# Altium project AQFlow_PCB.PrjPcb
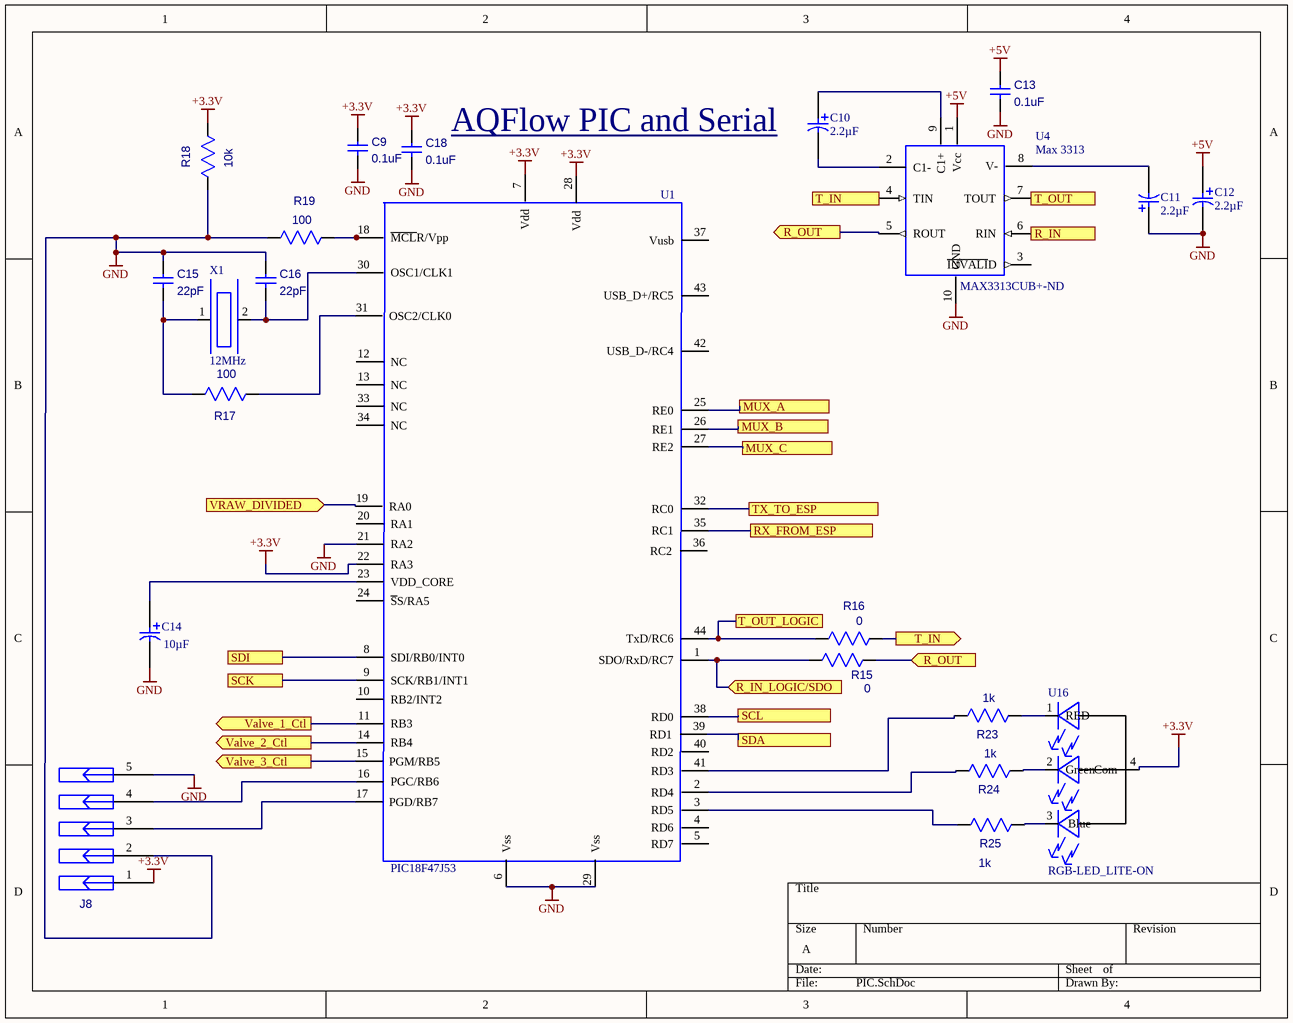
[diagram p0: PIC.SchDoc]
2 sheets, 58 parts. Net scope: flat (ports and power ports of the same name join across sheets).
Board file: AQFlow_PCB.PcbDoc
Sheets:
  PIC.SchDoc
  Power.SchDoc

## Sheet PIC.SchDoc
size A

### Parts
C9  value 0.1uF  [CC1206]  (hidden comment: CC1206)
C10  Capacitance: 2.2µF  [Cap_Pol_0805]  (hidden comment: Cap_Pol_0805)
C11  Capacitance: 2.2µF  [Cap_Pol_0805]  (hidden comment: Cap_Pol_0805)
C12  Capacitance: 2.2µF  [Cap_Pol_0805]  (hidden comment: Cap_Pol_0805)
C13  value 0.1uF  [CC1206]  (hidden comment: CC1206)
C14  Capacitance: 10µF  [Cap_Pol_0805]  (hidden comment: CAP_POL_0805 Generic)
C15  value 22pF  [CC1206]  (hidden comment: CC1206)
C16  value 22pF  [CC1206]  (hidden comment: CC1206)
C18  value 0.1uF  [CC1206]  (hidden comment: CC1206)
J8  HDR_MTA_5X100  [HDR_MTA_5X100]  (value not drawn)
R15  value 0  [RC1206]  (hidden comment: RC1206)
R16  value 0  [RC1206]  (hidden comment: RC1206)
R17  value 100  [RC1206]  (hidden comment: RC1206)
R18  value 10k  [RC1206]  (hidden comment: RC1206)
R19  value 100  [RC1206]  (hidden comment: RC1206)
R23  value 1k  [RC1206]  (hidden comment: RC1206)
R24  value 1k  [RC1206]  (hidden comment: RC1206)
R25  value 1k  [RC1206]  (hidden comment: RC1206)
U1  PIC18F47J53  [44-TQFP]
U4  Max 3313  Supplier Part Number 1: MAX3313CUB+-ND  [uSOP]
U16  RGB-LED_LITE-ON  [LTST-C19HE1WT]
X1  12MHz  [XTAL_MINI_ABM3]

### Ports
MUX_A, MUX_B, MUX_C, R_IN (in), R_IN_LOGIC/SDO (in), R_OUT (in), R_OUT (out), RX_FROM_ESP, SCK, SCL, SDA, SDI, T_IN (in), T_IN (out), T_OUT (out), T_OUT_LOGIC, TX_TO_ESP, Valve_1_Ctl (out), Valve_2_Ctl (out), Valve_3_Ctl (out), VRAW_DIVIDED (in)

### Nets
+3.3V: C9.1 C18.1 J8.1 R18.1 U1.7(Vdd) U1.22(RA3) U1.28(Vdd) U16.4(Com)
+5V: C12.plus C13.1 U4.1(Vcc)
GND: C9.2 C11.plus C12.minus C13.2 C14.minus C15.1 C16.1 C18.2 J8.2 J8.5 R18.2 R19.1 U1.6(Vss) U1.21(RA2) U1.29(Vss) U4.10(GND)
NetC10_minus: C10.minus U4.2(C1-)
NetC10_plus: C10.plus U4.9(C1+)
NetC11_minus: C11.minus U4.8(V-)
NetC14_plus: C14.plus U1.23(VDD_CORE)
NetC15_2: C15.2 R17.1 X1.1
NetC16_2: C16.2 U1.30(OSC1/CLK1) X1.2
NetJ1_3: U4.7(TOUT) ; port T_OUT
NetJ1_4: U4.6(RIN) ; port R_IN
NetJ1_5: U1.9(SCK/RB1/INT1) ; port SCK
NetJ1_6: U1.8(SDI/RB0/INT0) ; port SDI
NetJ1_7: R15.1 U1.1(SDO/RxD/RC7) ; port R_IN_LOGIC/SDO
NetJ1_8: R16.1 U1.44(TxD/RC6) ; port T_OUT_LOGIC
NetJ8_3: J8.3 U1.17(PGD/RB7)
NetJ8_4: J8.4 U1.16(PGC/RB6)
NetR8_1: U1.19(RA0) ; port VRAW_DIVIDED
NetR15_2: R15.2 U4.5(ROUT) ; port R_OUT
NetR16_2: R16.2 U4.4(TIN) ; port T_IN
NetR17_2: R17.2 U1.31(OSC2/CLK0)
NetR19_2: R19.2 U1.18(~{MCL}R/Vpp)
NetR23_1: R23.1 U1.41(RD3)
NetR23_2: R23.2 U16.1(RED)
NetR24_1: R24.1 U1.2(RD4)
NetR24_2: R24.2 U16.2(Green)
NetR25_1: R25.1 U1.3(RD5)
NetR25_2: R25.2 U16.3(Blue)
NetU1_11: U1.11(RB3) ; port Valve_1_Ctl
NetU1_14: U1.14(RB4) ; port Valve_2_Ctl
NetU1_15: U1.15(PGM/RB5) ; port Valve_3_Ctl
NetU1_25: U1.25(RE0) ; port MUX_A
NetU1_26: U1.26(RE1) ; port MUX_B
NetU1_27: U1.27(RE2) ; port MUX_C
NetU1_32: U1.32(RC0) ; port TX_TO_ESP
NetU1_35: U1.35(RC1) ; port RX_FROM_ESP
NetU1_38: U1.38(RD0) ; port SCL
NetU1_39: U1.39(RD1) ; port SDA

Not connected (* = marked no-connect by the designer): U1 4(RD6) 5(RD7) 10(RB2/INT2) 12(NC) 13(NC) 20(RA1) 24(~{S}S/RA5) 33(NC) 34(NC) 36(RC2) 37(Vusb) 40(RD2) 42(USB_D-/RC4) 43(USB_D+/RC5); U4 3(~{INVALI}D)

### Notes on the sheet
- (near C10) AQFlow PIC and Serial

### Library data of the parts
C10-C12 = Cap_Pol_0805: Manufacturer: AVX Corporation; Manufacturer Part Number: TAJR225K020RNJ; Manufacturer Size Code: R; Tolerance: ±10%; Voltage - Rated: 20V; ESR (Equivalent Series Resistance): 6 Ohm; Type: Molded; Supplier 1: Digi-Key; RoHS: RoHS Compliant; Category: Capacitors; Stock 1: 9954; Pricing 1: 1=1.24, 10=1.034, 100=0.66, 250=0.55, 500=0.495, 1000=0.451 (USD); Packaging: Cut Tape (CT); Operating Temperature: -55°C ~ 125°C; Mounting Type: Surface Mount; Package / Case: 0805 (2012 Metric); Size / Dimension: 0.081" L x 0.051" W (2.05mm x 1.30mm); Height - Seated (Max): 0.047" (1.20mm); Lead Spacing: -; Features: General Purpose; Lifetime @ Temp.: -; ComponentLink1URL: http://www.avx.com/docs/Catalogs/tajlp.pdf; ComponentLink1Description: http://www.avx.com/docs/Catalogs/tajlp.pdf; Supplier Part Number 1: 478-4693-1-ND
C14 = CAP_POL_0805 Generic: Manufacturer: Rohm Semiconductor; Manufacturer Part Number: TCTP1C106M8R; Manufacturer Size Code: P; Tolerance: ±20%; Voltage - Rated: 16V; ESR (Equivalent Series Resistance): 6 Ohm; Type: Molded; Supplier 1: Digi-Key; Supplier Part Number 1: 511-1683-2-ND; RoHS: RoHS Compliant; Category: Capacitors; Stock 1: 99000; Pricing 1: 3000=0.2055, 6000=0.1918, 9000=0.18495, 15000=0.18221, 30000=0.1781, 75000=0.17468, 150000=0.16783 (USD); Packaging: Tape & Reel (TR); Operating Temperature: -55°C ~ 125°C; Mounting Type: Surface Mount; Package / Case: 0805 (2012 Metric); Size / Dimension: 0.079" L x 0.049" W (2.00mm x 1.25mm); Height - Seated (Max): 0.047" (1.20mm); Lead Spacing: -; Features: General Purpose; Lifetime @ Temp.: -; ComponentLink1URL: http://rohmfs.rohm.com/en/products/databook/datasheet/passive/tantalum_capacitor/tantalum_chip_capacitor/tct_p.pdf; ComponentLink1Description: http://rohmfs.rohm.com/en/products/databook/datasheet/passive/tantalum_capacitor/tantalum_chip_capacitor/tct_p.pdf
U1 = PIC18F47J53: PIC uController; Manufacturer: Microchip Technology; Manufacturer Part Number: PIC18F47J53T-I/PT; Core Size: 8-Bit; Speed: 48MHz; Connectivity: I²C, LIN, SPI, UART/USART, USB; Peripherals: Brown-out Detect/Reset, POR, PWM, WDT; Number of I/O: 34; Program Memory Size: 128KB (64K x 16); Program Memory Type: FLASH; RAM Size: 3.8K x 8; Voltage - Supply (Vcc/Vdd): 2.15 V ~ 3.6 V; Data Converters: A/D 13x10b/12b; Oscillator Type: Internal; Supplier 1: Digi-Key; Supplier Part Number 1: PIC18F47J53T-I/PT-ND; RoHS: RoHS Compliant; Category: Integrated Circuits (ICs); Stock 1: 0; Pricing 1: 1200=3.42999 (USD); Packaging: Tape & Reel (TR); Core Processor: PIC; EEPROM Size: -; Operating Temperature: -40°C ~ 85°C; Package / Case: 44-TQFP; Supplier Device Package: 44-TQFP (10x10); ComponentLink1URL: http://www.microchip.com/mymicrochip/filehandler.aspx?ddocname=en548986; ComponentLink1Description: http://www.microchip.com/mymicrochip/filehandler.aspx?ddocname=en548986
X1 = XTAL_MINI_ABM3
J8 = HDR_MTA_5X100: Value: *
U4 = Max 3313: Supplier 1: Digi-Key

## Sheet Power.SchDoc
size A
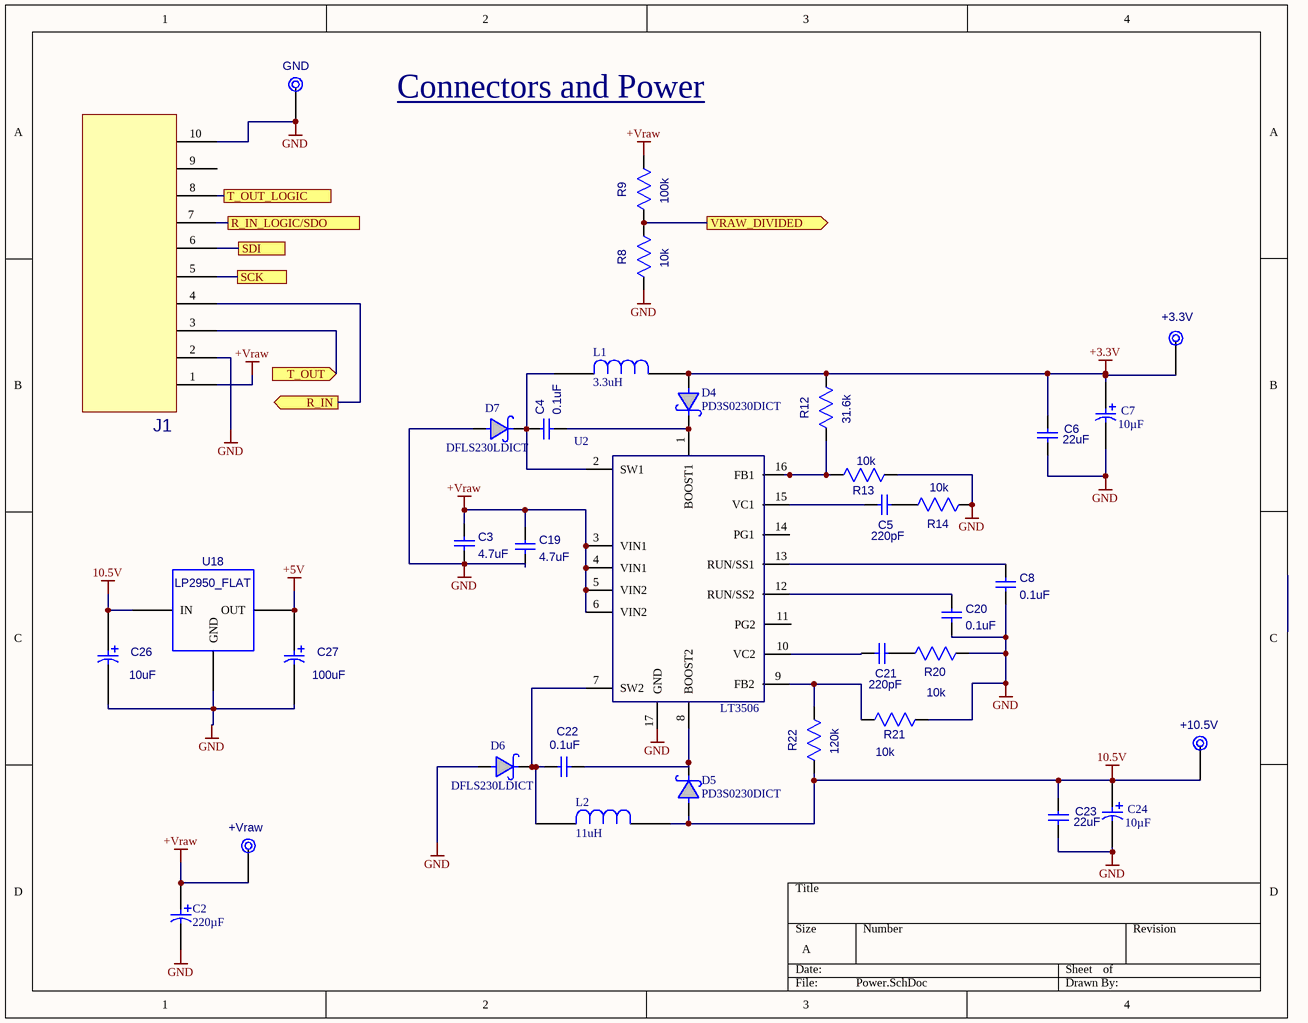
[diagram p1: Power.SchDoc]

### Parts
+5V  +3.3V  [PAD_TESTPOINT]
+10.5V  +10.5V  [PAD_TESTPOINT]
+Vraw  +Vraw  [PAD_TESTPOINT]
C2  Capacitance: 220µF  [Cap_Alu_UCL1V221MCL6GS]  (hidden comment: CAP_POL_Alu)
C3  value 4.7uF  [CC1206]  (hidden comment: CC1206)
C4  value 0.1uF  [CC1206]  (hidden comment: CC1206)
C5  value 220pF  [CC1206]  (hidden comment: CC1206)
C6  value 22uF  [CC1206]  (hidden comment: CC1206)
C7  Capacitance: 10µF  [Cap_Pol_0805]  (hidden comment: CAP_POL_0805 Generic)
C8  value 0.1uF  [CC1206]
C19  value 4.7uF  [CC1206]  (hidden comment: CC1206)
C20  value 0.1uF  [CC1206]
C21  value 220pF  [CC1206]  (hidden comment: CC1206)
C22  value 0.1uF  [CC1206]  (hidden comment: CC1206)
C23  value 22uF  [CC1206]  (hidden comment: CC1206)
C24  Capacitance: 10µF  [Cap_Pol_0805]  (hidden comment: CAP_POL_0805 Generic)
C26  value 10uF  [CAP_D_SMT_CAP_POL_D_PKG(Primary)]  (hidden comment: CAP_POL_D_PKG)
C27  value 100uF  [CAP_D_SMT_CAP_POL_D_PKG(Primary)]  (hidden comment: CAP_POL_D_PKG)
D4  PD3S0230DICT  [POWERDI123]
D5  PD3S0230DICT  [POWERDI123]
D6  DFLS230LDICT  [POWERDI123]
D7  DFLS230LDICT  [POWERDI123]
GND  GND  [PAD_TESTPOINT]
J1  TERM_BLOCK_10  [Terminal Block 10 Pos]  (value not drawn)
L1  value 3.3uH  [Inductor_Small]  (hidden comment: Inductor)
L2  value 11uH  [7447798111]  (hidden comment: Inductor)
R8  value 10k  [RC1206]  (hidden comment: RC1206)
R9  value 100k  [RC1206]  (hidden comment: RC1206)
R12  value 31.6k  [RC1206]  (hidden comment: RC1206)
R13  value 10k  [RC1206]  (hidden comment: RC1206)
R14  value 10k  [RC1206]  (hidden comment: RC1206)
R20  value 10k  [RC1206]  (hidden comment: RC1206)
R21  value 10k  [RC1206]  (hidden comment: RC1206)
R22  value 120k  [RC1206]  (hidden comment: RC1206)
U2  LT3506  [TSSOP16 Bottom Pad]
U18  LP2950_FLAT  [TO-252]

### Ports
R_IN (out), R_IN_LOGIC/SDO, SCK, SDI, T_OUT (in), T_OUT_LOGIC, VRAW_DIVIDED (out)

### Nets
10.5V: C26.plus U18.1(IN)
+3.3V: +5V.TP C6.1 C7.plus D4.A L1.1 R12.1
+5V: C27.plus U18.3(OUT)
+Vraw: +Vraw.TP C2.plus C3.1 C19.1 J1.1(P1) R9.1 U2.3(VIN1) U2.4(VIN1) U2.5(VIN2) U2.6(VIN2)
GND: C2.minus C3.2 C6.2 C7.minus C8.2 C19.2 C20.2 C23.2 C24.minus C26.minus C27.minus D6.A D7.A GND.TP J1.2(P2) J1.10(P10) R8.2 R13.2 R14.2 R20.2 R21.2 U2.17(GND) U18.2(GND)
Net+10.5V_TP: +10.5V.TP C23.1 C24.plus D5.A L2.1 R22.2
NetC4_1: C4.1 D7.K L1.2 U2.2(SW1)
NetC4_2: C4.2 D4.K U2.1(BOOST1)
NetC5_1: C5.1 R14.1
NetC5_2: C5.2 U2.15(VC1)
NetC8_1: C8.1 U2.13(RUN/SS1)
NetC20_1: C20.1 U2.12(RUN/SS2)
NetC21_1: C21.1 R20.1
NetC21_2: C21.2 U2.10(VC2)
NetC22_1: C22.1 D6.K L2.2 U2.7(SW2)
NetC22_2: C22.2 D5.K U2.8(BOOST2)
NetJ1_3: J1.3(P3) ; port T_OUT
NetJ1_4: J1.4(P4) ; port R_IN
NetJ1_5: J1.5(P5) ; port SCK
NetJ1_6: J1.6(P6) ; port SDI
NetJ1_7: J1.7(P7) ; port R_IN_LOGIC/SDO
NetJ1_8: J1.8(P8) ; port T_OUT_LOGIC
NetR8_1: R8.1 R9.2 ; port VRAW_DIVIDED
NetR12_2: R12.2 R13.1 U2.16(FB1)
NetR21_1: R21.1 R22.1 U2.9(FB2)

Not connected (* = marked no-connect by the designer): J1 9(P9); U2 11(PG2) 14(PG1)

### Notes on the sheet
- Connectors and Power
- Labels drawn without touching a wire or pin: 10.5V

### Library data of the parts
+5V +10.5V +Vraw GND = PAD: Test Point; Value: *
C2 = CAP_POL_Alu: Manufacturer: Nichicon; Manufacturer Part Number: UCL1V221MCL6GS; Tolerance: ±20%; Voltage Rating: 35V; Lifetime @ Temp.: 2000 Hrs @ 105°C; Ripple Current: 850mA; Impedance: 100 mOhm; Surface Mount Land Size: 0.406" L x 0.406" W (10.30mm x 10.30mm); Supplier 1: Digi-Key; RoHS: RoHS Compliant; Category: Capacitors; Stock 1: 6274; Pricing 1: 1=1.15, 10=0.962, 25=0.8292, 50=0.7778, 100=0.6141, 250=0.51176 (USD); Packaging: Cut Tape (CT); ESR (Equivalent Series Resistance): -; Operating Temperature: -55°C ~ 105°C; Type: -; Applications: General Purpose; Lead Spacing: -; Size / Dimension: 0.394" Dia (10.00mm); Height - Seated (Max): 0.303" (7.70mm); Mounting Type: Surface Mount; Package / Case: Radial, Can - SMD; ComponentLink1URL: http://nichicon-us.com/english/products/pdfs/e-cl.pdf; ComponentLink1Description: http://nichicon-us.com/english/products/pdfs/e-cl.pdf; Supplier Part Number 1: 493-3958-1-ND
C7 C24 = CAP_POL_0805 Generic: as C14 on sheet PIC; Supplier 1: Digi-Key; Supplier Part Number 1: 511-1683-2-ND; RoHS: RoHS Compliant; Category: Capacitors; Stock 1: 99000; Pricing 1: 3000=0.2055, 6000=0.1918, 9000=0.18495, 15000=0.18221, 30000=0.1781, 75000=0.17468, 150000=0.16783 (USD); Packaging: Tape & Reel (TR); Operating Temperature: -55°C ~ 125°C; Mounting Type: Surface Mount; Package / Case: 0805 (2012 Metric); Size / Dimension: 0.079" L x 0.049" W (2.00mm x 1.25mm); Height - Seated (Max): 0.047" (1.20mm); Lead Spacing: -; Features: General Purpose; Lifetime @ Temp.: -; ComponentLink1URL: http://rohmfs.rohm.com/en/products/databook/datasheet/passive/tantalum_capacitor/tantalum_chip_capacitor/tct_p.pdf; ComponentLink1Description: http://rohmfs.rohm.com/en/products/databook/datasheet/passive/tantalum_capacitor/tantalum_chip_capacitor/tct_p.pdf
C8 C20 = CC1206
D4 D5 = PD3S0230DICT: Manufacturer: Diodes Incorporated; Manufacturer Part Number: PD3S0230-7; Diode Type: Schottky; Voltage - DC Reverse (Vr) (Max): 30V; Current - Average Rectified (Io): 200mA (DC); Voltage - Forward (Vf) (Max) @ If: 800mV @ 100mA; Speed: Small Signal =< 200mA (Io), Any Speed; Reverse Recovery Time (trr): 5ns; Current - Reverse Leakage @ Vr: 2µA @ 25V; Capacitance @ Vr, F: 10.7pF @ 1V, 1MHz; Supplier 1: Digi-Key; RoHS: RoHS Compliant; Category: Discrete Semiconductor Products; Stock 1: 4247; Pricing 1: 1=0.49, 10=0.412, 25=0.3612, 100=0.309, 250=0.268, 500=0.227, 1000=0.175 (USD); Packaging: Digi-Reel®; Mounting Type: Surface Mount; Package / Case: PowerDI™ 323; Supplier Device Package: PowerDI™ 323; Operating Temperature - Junction: -65°C ~ 125°C; ComponentLink1URL: http://www.diodes.com/datasheets/ds30722.pdf; ComponentLink1Description: http://www.diodes.com/datasheets/ds30722.pdf; Supplier Part Number 1: PD3S0230DIDKR-ND
D6 D7 = DFLS230LDICT: Manufacturer: Diodes Incorporated; Manufacturer Part Number: DFLS230L-7; Diode Type: Schottky; Voltage - DC Reverse (Vr) (Max): 30V; Current - Average Rectified (Io): 2A; Voltage - Forward (Vf) (Max) @ If: 420mV @ 2A; Speed: Fast Recovery =< 500ns, > 200mA (Io); Current - Reverse Leakage @ Vr: 1mA @ 30V; Capacitance @ Vr, F: 76pF @ 10V, 1MHz; Supplier 1: Digi-Key; RoHS: RoHS Compliant; Category: Discrete Semiconductor Products; Stock 1: 8959; Pricing 1: 1=0.74, 10=0.65, 25=0.5744, 100=0.5004, 250=0.4356, 500=0.3708, 1000=0.297 (USD); Packaging: Digi-Reel®; Reverse Recovery Time (trr): -; Mounting Type: Surface Mount; Package / Case: POWERDI®123; Supplier Device Package: PowerDI™ 123; Operating Temperature - Junction: -40°C ~ 125°C; ComponentLink1URL: http://www.diodes.com/datasheets/ds30515.pdf; ComponentLink1Description: http://www.diodes.com/datasheets/ds30515.pdf; Supplier Part Number 1: DFLS230LDIDKR-ND
L1 = Inductor: Manufacturer: Eaton Bussmann; Manufacturer Part Number: EATON SD53-3R3-R; Type: Wirewound; Material - Core: Ferrite; Inductance: 4.7µH; Tolerance: ±20%; Current Rating: 2.01A; Current - Saturation: 2.1A; Shielding: Shielded; DC Resistance (DCR): 45 mOhm Max; Frequency - Test: 100kHz; Supplier 1: Digi-Key; Supplier Part Number 1: 513-1455-1-ND; RoHS: RoHS Compliant; Category: Inductors, Coils, Chokes; Stock 1: 2548; Pricing 1: 1=1.48, 10=1.388, 50=1.11, 100=1.0545, 500=0.851, 1000=0.777 (USD); Packaging: Cut Tape (CT); Q @ Freq: -; Frequency - Self Resonant: -; Operating Temperature: -40°C ~ 125°C; Mounting Type: Surface Mount; Package / Case: Nonstandard; Size / Dimension: 0.204" L x 0.204" W (5.20mm x 5.20mm); Height - Seated (Max): 0.118" (3.00mm); Supplier Device Package: -; ComponentLink1URL: http://www.cooperindustries.com/content/dam/public/bussmann/Electronics/Resources/product-datasheets/Bus_Elx_DS_PM-4149_SD53_Series.pdf; ComponentLink1Description: http://www.cooperindustries.com/content/dam/public/bussmann/Electronics/Resources/product-datasheets/Bus_Elx_DS_PM-4149_SD53_Series.pdf
L2 = Inductor: Manufacturer: Wurth Electronics Inc; Type: Wirewound; Material - Core: Metal Composite; Inductance: 11µH; Tolerance: ±20%; Current Rating: 6.9A; Current - Saturation: 5.3A; Shielding: Shielded; DC Resistance (DCR): 15.8 mOhm Max; Frequency - Self Resonant: 25MHz; Frequency - Test: 100kHz; Supplier 1: Digi-Key; Supplier Part Number 1: 732-2414-2-ND; Manufacturer Part Number: 7447798111; RoHS: RoHS Compliant; Category: Inductors, Coils, Chokes; Stock 1: 500; Pricing 1: 500=2.49374 (USD); Packaging: Tape & Reel (TR); Q @ Freq: -; Operating Temperature: -40°C ~ 150°C; Mounting Type: Surface Mount; Package / Case: Nonstandard; Size / Dimension: 0.402" L x 0.402" W (10.20mm x 10.20mm); Height - Seated (Max): 0.252" (6.40mm); Supplier Device Package: -; ComponentLink1URL: http://katalog.we-online.de/pbs/datasheet/7447798111.pdf; ComponentLink1Description: http://katalog.we-online.de/pbs/datasheet/7447798111.pdf
U2 = LT3506: Manufacturer: Linear Technology; Manufacturer Part Number: LT3506AEFE#PBF; Output Type: Adjustable; Number of Outputs: 2; Voltage - Output: 0.8 V ~ 22 V; Voltage - Input: 3.6 V ~ 25 V; Frequency - Switching: 1.1MHz; Current - Output: 1.6A; Synchronous Rectifier: No; Supplier 1: Digi-Key; RoHS: RoHS Compliant; Category: Integrated Circuits (ICs); Stock 1: 337; Pricing 1: 1=6.13, 25=4.36, 100=3.59 (USD); Packaging: Tube; Type: Step-Down (Buck); Operating Temperature: -40°C ~ 85°C; Mounting Type: Surface Mount; Package / Case: 16-TSSOP (0.173", 4.40mm Width) Exposed Pad; Supplier Device Package: 16-TSSOP-EP; ComponentLink1URL: http://www.linear.com/docs/16297; ComponentLink1Description: http://www.linear.com/docs/16297; Supplier Part Number 1: LT3506AEFE#PBF-ND
J1 = TERM_BLOCK_10: Value: *
U18 = LP2950_FLAT: Value: *

## Nets that join several sheets
+3.3V: PIC (8 pins), Power (6 pins)
+5V: PIC (C12.plus C13.1 U4.1), Power (C27.plus U18.3)
GND: PIC (16 pins), Power (23 pins)
NetJ1_3: PIC (U4.7), Power (J1.3)
NetJ1_4: PIC (U4.6), Power (J1.4)
NetJ1_5: PIC (U1.9), Power (J1.5)
NetJ1_6: PIC (U1.8), Power (J1.6)
NetJ1_7: PIC (R15.1 U1.1), Power (J1.7)
NetJ1_8: PIC (R16.1 U1.44), Power (J1.8)
NetR8_1: PIC (U1.19), Power (R8.1 R9.2)